# Altium schematic sheet 拉线式变速器-V3.SchDoc
size A2
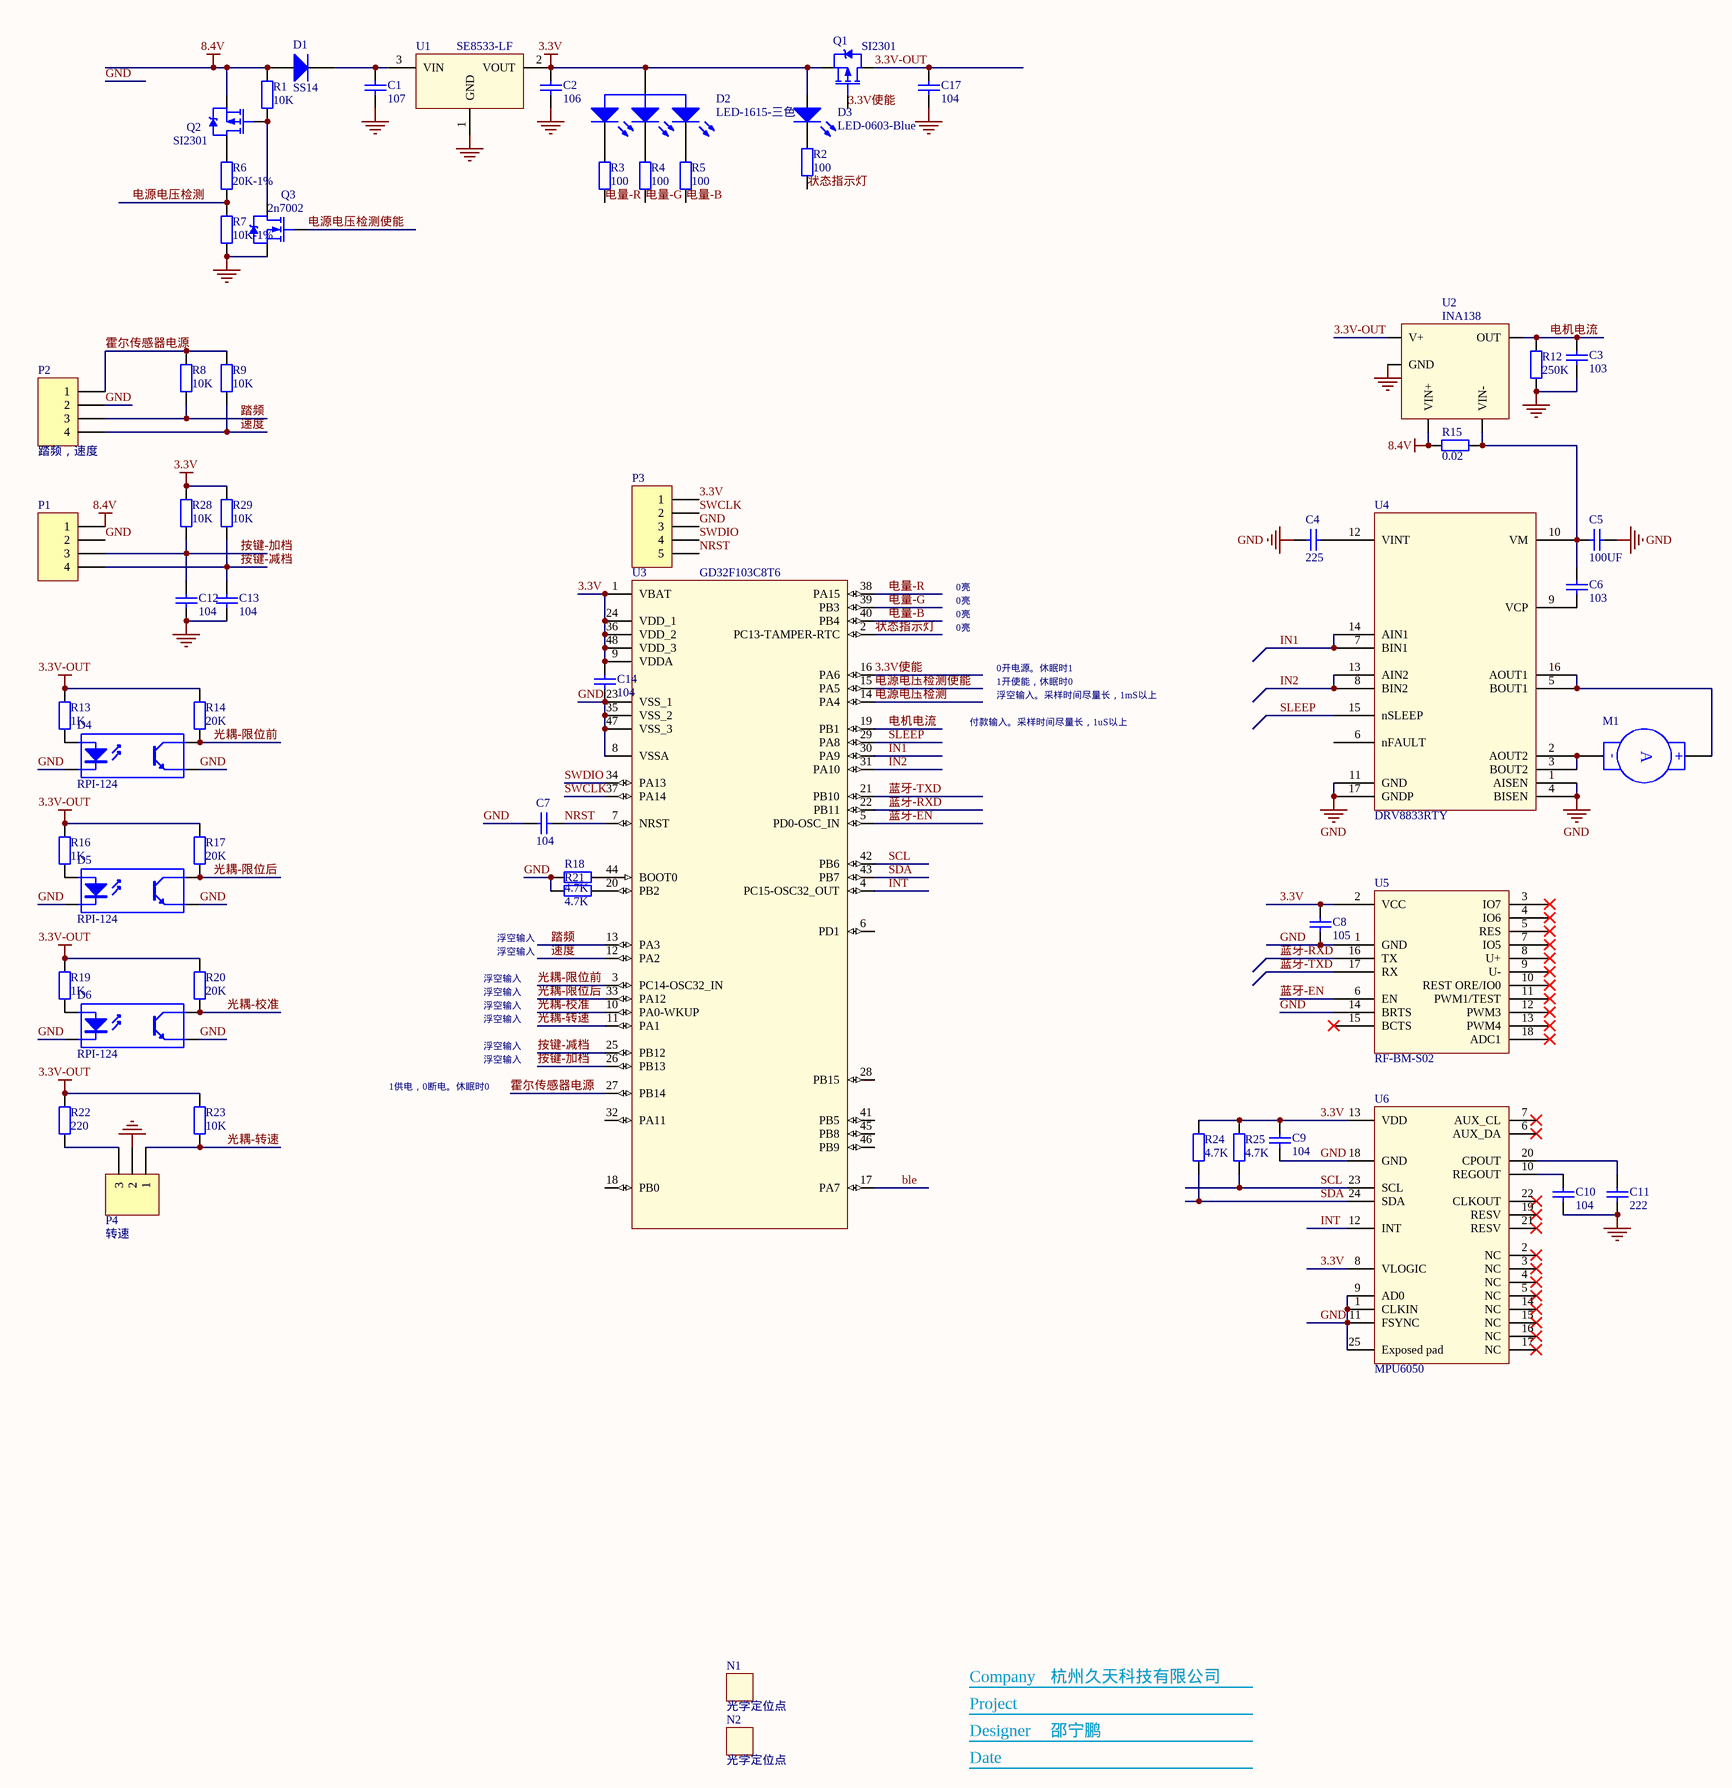
[diagram p0: 拉线式变速器-V3.SchDoc]

## Parts
C1  107  [C-1206]
C2  106  [C-0603-M]
C3  103  [C-0603-M]
C4  225  [C-0603-M]
C5  100UF  [C-1206-M]
C6  103  [C-0603-M]
C7  104  [C-0603-M]
C8  105  [C-0603-M]
C9  104  [C-0603-m]
C10  104  [C-0603-m]
C11  222  [C-0603-m]
C12  104  [C-0603-M]
C13  104  [C-0603-M]
C14  104  [C-0603-M]
C17  104  [C-0603-M]
D1  SS14  [D-0603-M]
D2  LED-1615-三色  [LED-1615-三色]
D3  LED-0603-Blue  [LED-0603-Blue]
D4  RPI-124  [RPI-124]
D5  RPI-124  [RPI-124]
D6  RPI-124  [RPI-124]
M1  (no value)  [ZH1.5-2P-插件-直针]
N1  光学定位点  [MARK-1mm-3mm]
N2  光学定位点  [MARK-1mm-3mm]
P1  (no value)  [ZH1.5-4P-插件-直针]
P2  踏频，速度  [ZH1.5-4P-插件-直针]
P3  (no value)  [5P下载口]
P4  转速  [ZH1.5-3P-插件-直针]
Q1  SI2301  [SOT-23]
Q2  SI2301  [SOT-23]
Q3  2n7002  [SOT-23]
R1  10K  [R-0603-M]
R2  100  [R-0603-M]
R3  100  [R-0603-M]
R4  100  [R-0603-M]
R5  100  [R-0603-M]
R6  20K-1%  [R-0603-M]
R7  10K-1%  [R-0603-M]
R8  10K  [R-0603-m]
R9  10K  [R-0603-m]
R12  250K  [R-0603-m]
R13  1K  [R-0603-m]
R14  20K  [R-0603-m]
R15  0.02  [R-0603-m]
R16  1K  [R-0603-m]
R17  20K  [R-0603-m]
R18  4.7K  [R-0603-m]
R19  1K  [R-0603-m]
R20  20K  [R-0603-m]
R21  4.7K  [R-0603-m]
R22  220  [R-0603-m]
R23  10K  [R-0603-m]
R24  4.7K  [R-0603-M]
R25  4.7K  [R-0603-M]
R28  10K  [R-0603-m]
R29  10K  [R-0603-m]
U1  SE8533-LF  [SOT-23]
U2  INA138  [SOT-23-5-N]
U3  GD32F103C8T6  [LQFP48-L]
U4  DRV8833RTY  [QFN-16+1]
U5  RF-BM-S02  [RF-BM-S02]
U6  MPU6050  [QFN-24]

## Nets
3.3V: C2.2 C8.1 C9.1 C14.1 D2.2(A) D3.1(A) P3.1 Q1.2(S) R24.2 R25.2 R28.1 R29.1 U1.2(VOUT) U3.1(VBAT) U3.9(VDDA) U3.24(VDD_1) U3.36(VDD_2) U3.48(VDD_3) U5.2(VCC) U6.8(VLOGIC) U6.13(VDD)
3.3V-OUT: C17.1 Q1.3(D) R13.2 R14.2 R16.2 R17.2 R19.2 R20.2 R22.2 R23.2 U2.5(V+)
8.4V: D1.1(A) P1.1 Q2.2(S) R1.1 R15.2 U2.3(VIN+)
GND: C1.1 C2.1 C3.2 C4.1 C5.1 C7.1 C8.2 C9.2 C10.2 C11.2 C12.1 C13.1 C14.2 C17.2 D4.2(K) D4.3(E) D5.2(K) D5.3(E) D6.2(K) D6.3(E) P1.2 P2.2 P3.3 P4.2 Q3.2(S) R7.2 R12.1 R18.2 R21.2 U1.1(GND) U2.2(GND) U3.8(VSSA) U3.23(VSS_1) U3.35(VSS_2) U3.47(VSS_3) U4.1(AISEN) U4.4(BISEN) U4.11(GND) U4.17(GNDP) U5.1(GND) U5.14(BRTS) U6.1(CLKIN) U6.9(AD0) U6.11(FSYNC) U6.18(GND) U6.25(Exposed_pad)
3.3V使能: Q1.1(G) U3.16(PA6)
ble: U3.17(PA7)
IN1: U3.30(PA9) U4.7(BIN1) U4.14(AIN1)
IN2: U3.31(PA10) U4.8(BIN2) U4.13(AIN2)
INT: U3.4(PC15-OSC32_OUT) U6.12(INT)
NRST: C7.2 P3.5 U3.7(NRST)
SCL: R25.1 U3.42(PB6) U6.23(SCL)
SDA: R24.1 U3.43(PB7) U6.24(SDA)
SLEEP: U3.29(PA8) U4.15(nSLEEP)
SWCLK: P3.2 U3.37(PA14)
SWDIO: P3.4 U3.34(PA13)
光耦-校准: D6.4(C) R20.1 U3.10(PA0-WKUP)
光耦-转速: P4.1 R23.1 U3.11(PA1)
光耦-限位前: D4.4(C) R14.1 U3.3(PC14-OSC32_IN)
光耦-限位后: D5.4(C) R17.1 U3.33(PA12)
按键-减档: C13.2 P1.4 R29.2 U3.25(PB12)
按键-加档: C12.2 P1.3 R28.2 U3.26(PB13)
状态指示灯: R2.1 U3.2(PC13-TAMPER-RTC)
电机电流: C3.1 R12.2 U2.1(OUT) U3.19(PB1)
电源电压检测: R6.2 R7.1 U3.14(PA4)
电源电压检测使能: Q3.1(G) U3.15(PA5)
电量-B: R5.1 U3.40(PB4)
电量-G: R4.1 U3.39(PB3)
电量-R: R3.1 U3.38(PA15)
蓝牙-EN: U3.5(PD0-OSC_IN) U5.6(EN)
蓝牙-RXD: U3.22(PB11) U5.16(TX)
蓝牙-TXD: U3.21(PB10) U5.17(RX)
踏频: P2.3 R8.2 U3.13(PA3)
速度: P2.4 R9.2 U3.12(PA2)
霍尔传感器电源: P2.1 R8.1 R9.1 U3.27(PB14)
NetC1_2: C1.2 D1.2(K) U1.3(VIN)
NetC4_2: C4.2 U4.12(VINT)
NetC5_2: C5.2 C6.1 R15.1 U2.4(VIN-) U4.10(VM)
NetC6_2: C6.2 U4.9(VCP)
NetC10_1: C10.1 U6.10(REGOUT)
NetC11_1: C11.1 U6.20(CPOUT)
NetD2_1: D2.1(R) R3.2
NetD2_3: D2.3(B) R5.2
NetD2_4: D2.4(G) R4.2
NetD3_2: D3.2(K) R2.2
NetD4_1: D4.1(A) R13.1
NetD5_1: D5.1(A) R16.1
NetD6_1: D6.1(A) R19.1
NetM1_1: M1.1(+) U4.5(BOUT1) U4.16(AOUT1)
NetM1_2: M1.2(-) U4.2(AOUT2) U4.3(BOUT2)
NetP4_3: P4.3 R22.1
NetQ2_1: Q2.1(G) Q3.3(D) R1.2
NetQ2_3: Q2.3(D) R6.1
NetR18_1: R18.1 U3.44(BOOT0)
NetR21_1: R21.1 U3.20(PB2)

Not connected (* = marked no-connect by the designer): U3 6(PD1) 18(PB0) 28(PB15) 32(PA11) 41(PB5) 45(PB8) 46(PB9); U4 6(nFAULT); U5 3(IO7)* 4(IO6)* 5(RES)* 7(IO5)* 8(U+)* 9(U-)* 10(REST_ORE/IO0)* 11(PWM1/TEST)* 12(PWM3)* 13(PWM4)* 15(BCTS)* 18(ADC1)*; U6 2(NC)* 3(NC)* 4(NC)* 5(NC)* 6(AUX_DA)* 7(AUX_CL)* 14(NC)* 15(NC)* 16(NC)* 17(NC)* 19(RESV)* 21(RESV)* 22(CLKOUT)*

## Notes on the sheet
- 0亮
- 0开电源。休眠时1
- 1开使能，休眠时0
- 浮空输入。采样时间尽量长，1mS以上
- 付款输入。采样时间尽量长，1uS以上
- 浮空输入
- 1供电，0断电。休眠时0
- Project
- Company
- 杭州久天科技有限公司
- Designer
- Date
- 邵宁鹏
- (in symbol Motor Servo) A

## Library data of the parts
C1-C4 C6 C7 C9-C14 C17 = Cap-0603: 0805; Published: 8-Jun-2000; LatestRevisionDate: 17-Jul-2002; LatestRevisionNote: Re-released for DXP Platform.; PackageReference: RAD-0.3; Publisher: Altium Limited
C5 = Cap-0805: 0805; Published: 8-Jun-2000; LatestRevisionDate: 17-Jul-2002; LatestRevisionNote: Re-released for DXP Platform.; PackageReference: RAD-0.3; Publisher: Altium Limited
C8 = Cap: 0805; Published: 8-Jun-2000; LatestRevisionDate: 17-Jul-2002; LatestRevisionNote: Re-released for DXP Platform.; PackageReference: RAD-0.3; Publisher: Altium Limited
D1 = SS14: SMA
D4-D6 = GP1S21: 光电
M1 = Motor Servo: 直流电机; Published: 24-Mar-1999; LatestRevisionDate: 17-Jul-2002; LatestRevisionNote: Re-released for DXP Platform.; PackageReference: RAD-0.4; Publisher: Altium Limited
N1 N2 = 无引脚
P1 P2 = Header 4: Header, 4-Pin; LatestRevisionDate: 17-Jul-2002; LatestRevisionNote: Re-released for DXP Platform.; Publisher: Altium Limited
P3 = Header 5: Header, 5-Pin; LatestRevisionDate: 17-Jul-2002; LatestRevisionNote: Re-released for DXP Platform.; Publisher: Altium Limited
P4 = Header 3: Header, 3-Pin; LatestRevisionDate: 17-Jul-2002; LatestRevisionNote: Re-released for DXP Platform.; Publisher: Altium Limited
Q1 Q2 = SI2301: SOT-23
Q3 = SI2300: SOT-23
R1-R9 R12-R25 R28 R29 = Res2-0603: 0603; Published: 8-Jun-2000; LatestRevisionDate: 17-Jul-2002; LatestRevisionNote: Re-released for DXP Platform.; PackageReference: AXIAL-0.4; Publisher: Altium Limited
U4 = DRV8833RTY: 刷式电机驱动芯片
U6 = MPU6050: 三轴陀螺仪加速度传感器
D3 = LED-0603-Blue: Published: 8-Jun-2000; LatestRevisionDate: 08-Jul-2005; LatestRevisionNote: Mech Layer 1 removed.; PackageReference: LED-0; Publisher: Altium Limited